# Altium schematic sheet Communication_Management.SchDoc
size A2; SheetNumber: 4; SheetTotal: 4
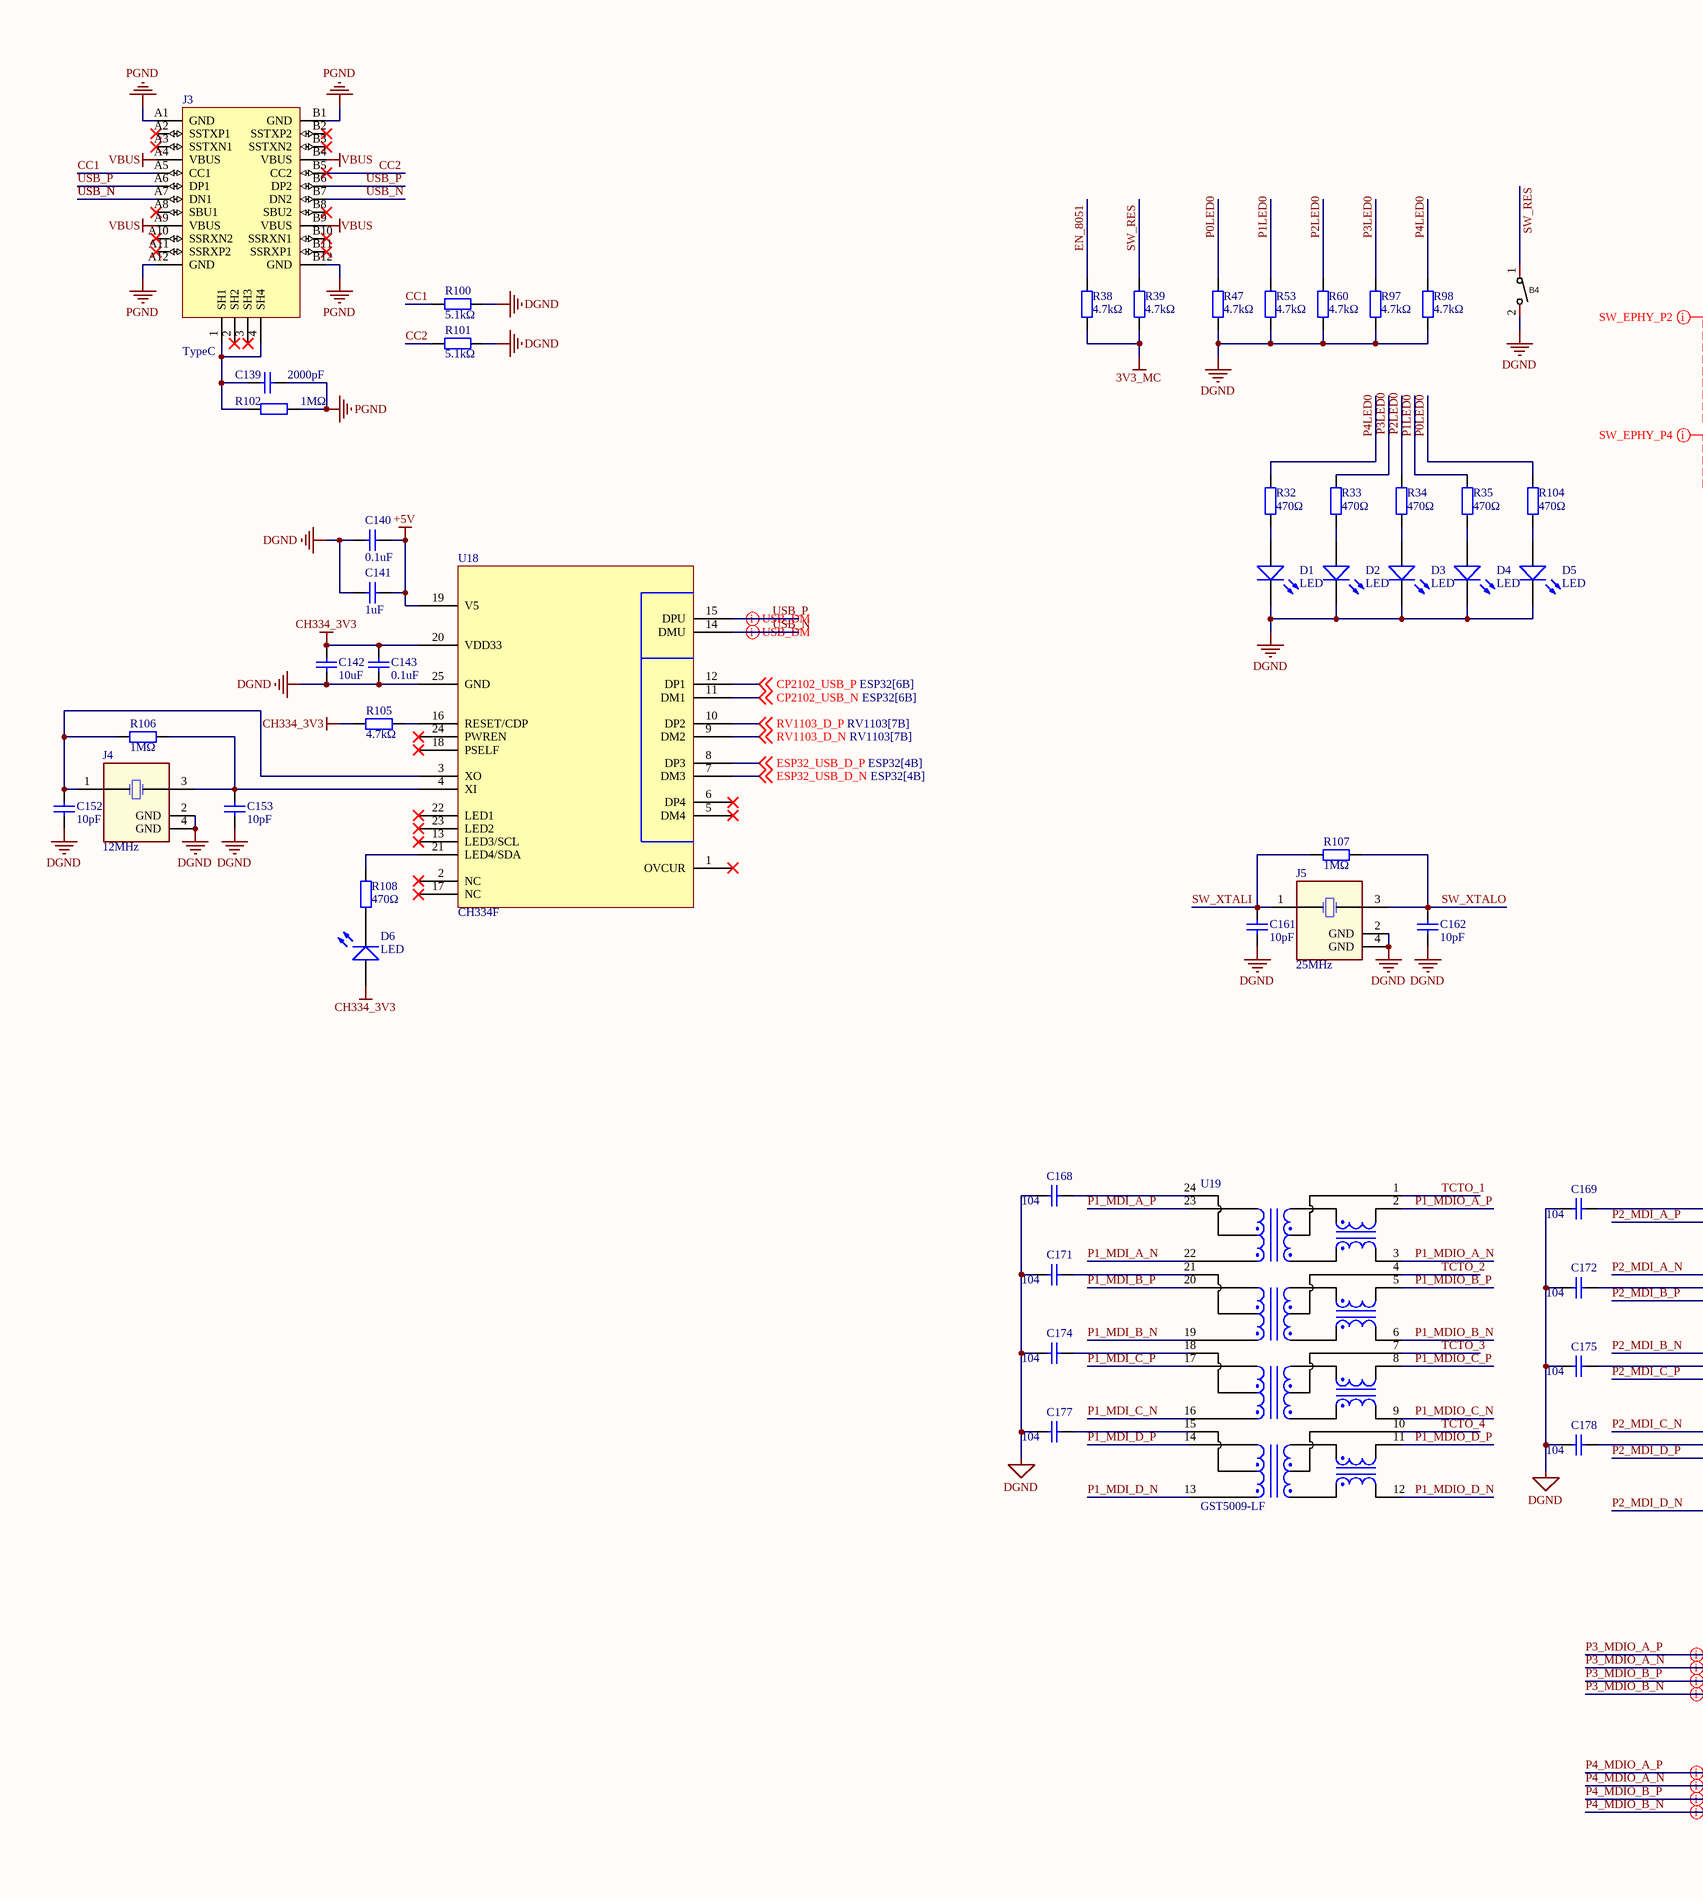
[diagram p0: Communication_Management.SchDoc, left]
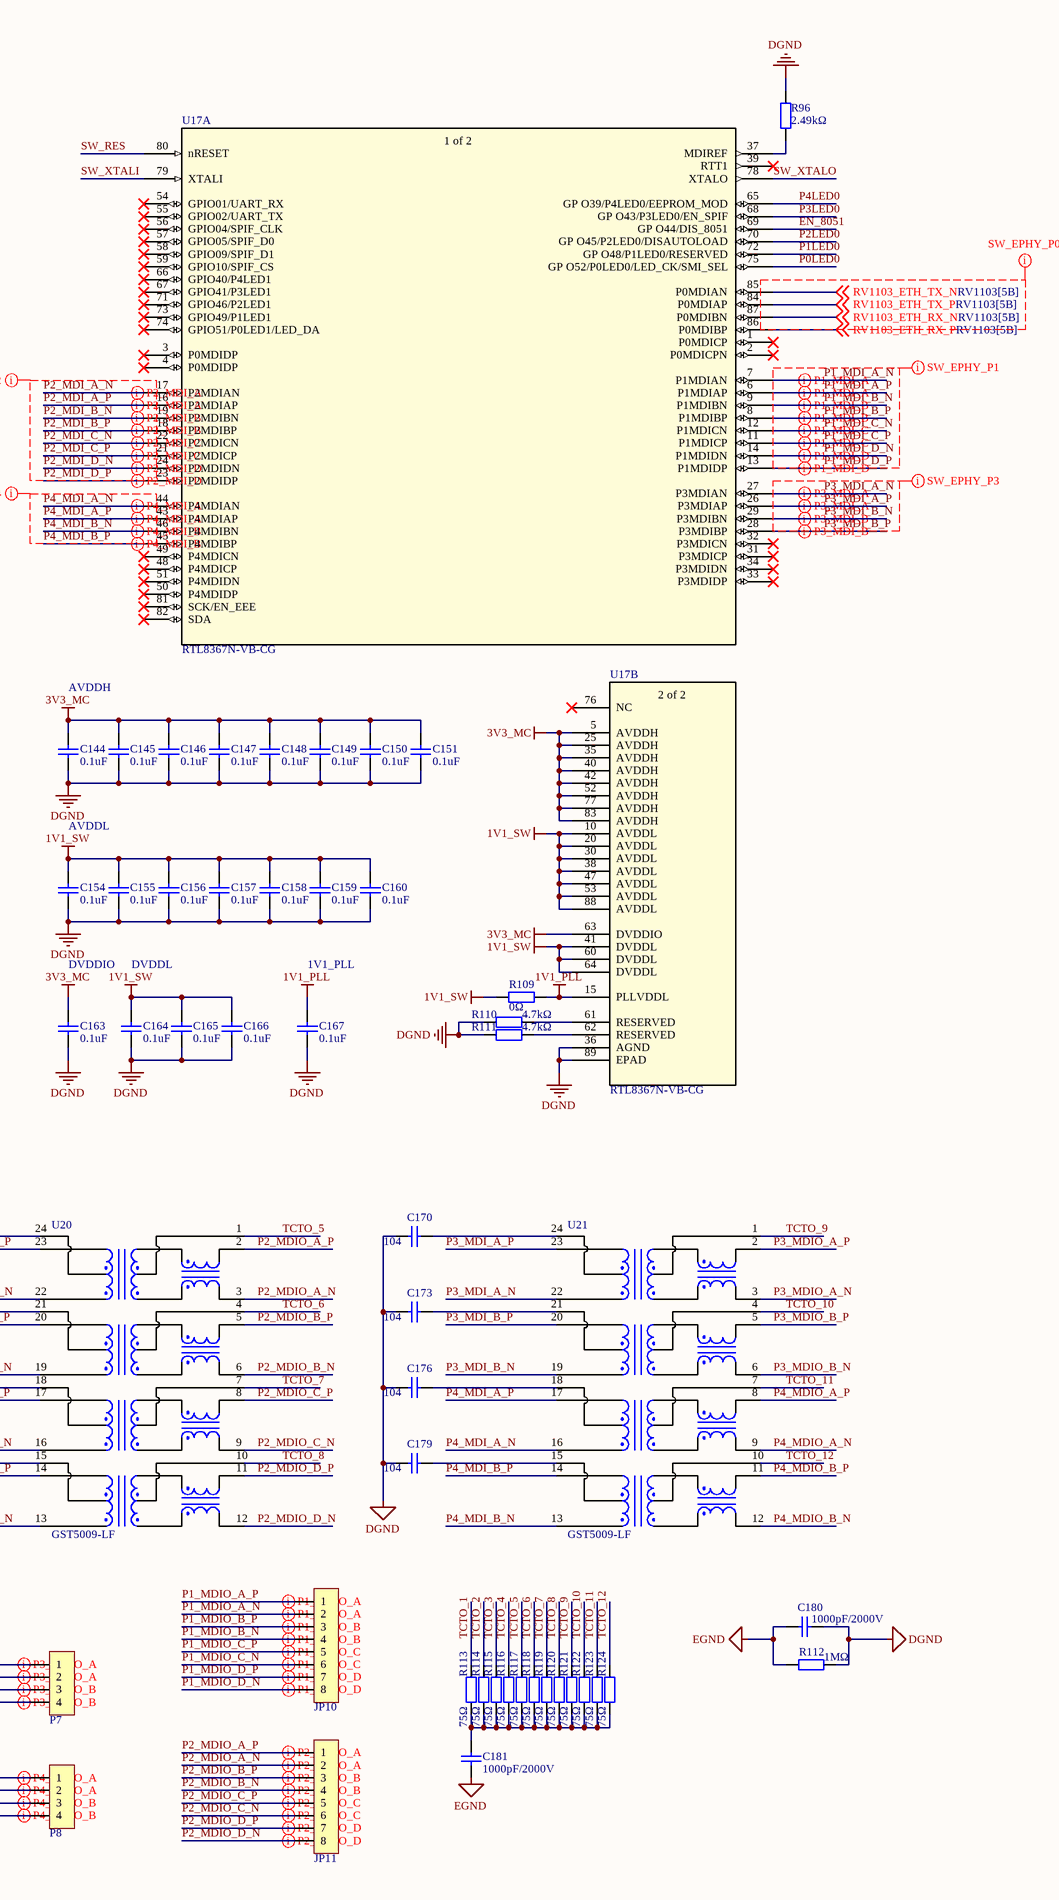
[diagram p1: Communication_Management.SchDoc, right]

## Parts
B4  Bottom-2P-1Way  [SW-SMD_L4.0-W2.9-LS5.0]  (value not drawn)
C139  2000pF  [1210_C]
C140  0.1uF  [0603_C]
C141  1uF  [0603_C]
C142  10uF  [0603_C]
C143  0.1uF  [0603_C]
C144  0.1uF  [0402_C]
C145  0.1uF  [0402_C]
C146  0.1uF  [0402_C]
C147  0.1uF  [0402_C]
C148  0.1uF  [0402_C]
C149  0.1uF  [0402_C]
C150  0.1uF  [0402_C]
C151  0.1uF  [0402_C]
C152  10pF  [0603_C]
C153  10pF  [0603_C]
C154  0.1uF  [0402_C]
C155  0.1uF  [0402_C]
C156  0.1uF  [0402_C]
C157  0.1uF  [0402_C]
C158  0.1uF  [0402_C]
C159  0.1uF  [0402_C]
C160  0.1uF  [0402_C]
C161  10pF  [0402_C]
C162  10pF  [0402_C]
C163  0.1uF  [0402_C]
C164  0.1uF  [0402_C]
C165  0.1uF  [0402_C]
C166  0.1uF  [0402_C]
C167  0.1uF  [0402_C]
C168  104  [0402_C]
C169  104  [0402_C]
C170  104  [0402_C]
C171  104  [0402_C]
C172  104  [0402_C]
C173  104  [0402_C]
C174  104  [0402_C]
C175  104  [0402_C]
C176  104  [0402_C]
C177  104  [0402_C]
C178  104  [0402_C]
C179  104  [0402_C]
C180  1000pF/2000V  [1210_C]
C181  1000pF/2000V  [1210_C]
D1  LED  [0603_LED]
D2  LED  [0603_LED]
D3  LED  [0603_LED]
D4  LED  [0603_LED]
D5  LED  [0603_LED]
D6  LED  [0603_LED]
J3  TypeC  [TYPE-C 16P]
J4  12MHz  [SMD-2520_4P]
J5  25MHz  [SMD-2520_4P]
JP10  HDR-1X8  [MX 1.25-LI-8P]  (value not drawn)
JP11  HDR-1X8  [MX 1.25-LI-8P]  (value not drawn)
P7  HDR-1X4  [MX 1.25-LI-4P]  (value not drawn)
P8  HDR-1X4  [MX 1.25-LI-4P]  (value not drawn)
R32  470Ω  [0603_R]
R33  470Ω  [0603_R]
R34  470Ω  [0603_R]
R35  470Ω  [0603_R]
R38  4.7kΩ  [0402_R]
R39  4.7kΩ  [0402_R]
R47  4.7kΩ  [0402_R]
R53  4.7kΩ  [0402_R]
R60  4.7kΩ  [0402_R]
R96  2.49kΩ  [0402_R]
R97  4.7kΩ  [0402_R]
R98  4.7kΩ  [0402_R]
R100  5.1kΩ  [0603_R]
R101  5.1kΩ  [0603_R]
R102  1MΩ  [1206_R]
R104  470Ω  [0603_R]
R105  4.7kΩ  [0603_R]
R106  1MΩ  [0603_R]
R107  1MΩ  [0603_R]
R108  470Ω  [0603_R]
R109  0Ω  [0402_R]
R110  4.7kΩ  [0402_R]
R111  4.7kΩ  [0402_R]
R112  1MΩ  [1206_R]
R113  75Ω  [0402_R]
R114  75Ω  [0402_R]
R115  75Ω  [0402_R]
R116  75Ω  [0402_R]
R117  75Ω  [0402_R]
R118  75Ω  [0402_R]
R119  75Ω  [0402_R]
R120  75Ω  [0402_R]
R121  75Ω  [0402_R]
R122  75Ω  [0402_R]
R123  75Ω  [0402_R]
R124  75Ω  [0402_R]
U17  RTL8367N-VB-CG  [QFN88-10x10MM]  (parts A,B of 2)
U18  CH334F  [QFN50P400X400X80_HS-25N]
U19  GST5009-LF  [SOP100P1000X400-24N]
U20  GST5009-LF  [SOP100P1000X400-24N]
U21  GST5009-LF  [SOP100P1000X400-24N]

## Nets
1V1_PLL: C167.2 R109.2 U17.15(PLLVDDL)
1V1_SW: C154.2 C155.2 C156.2 C157.2 C158.2 C159.2 C160.2 C164.2 C165.2 C166.2 R109.1 U17.10(AVDDL) U17.20(AVDDL) U17.30(AVDDL) U17.38(AVDDL) U17.41(DVDDL) U17.47(AVDDL) U17.53(AVDDL) U17.60(DVDDL) U17.64(DVDDL) U17.88(AVDDL)
3V3_MC: C144.2 C145.2 C146.2 C147.2 C148.2 C149.2 C150.2 C151.2 C163.2 R38.2 R39.2 U17.5(AVDDH) U17.25(AVDDH) U17.35(AVDDH) U17.40(AVDDH) U17.42(AVDDH) U17.52(AVDDH) U17.63(DVDDIO) U17.77(AVDDH) U17.83(AVDDH)
+5V: C140.2 C141.2 U18.19(V5)
CH334_3V3: C142.2 C143.2 D6.A R105.1 U18.20(VDD33)
DGND: B4.2 C140.1 C141.1 C142.1 C143.1 C144.1 C145.1 C146.1 C147.1 C148.1 C149.1 C150.1 C151.1 C152.1 C153.1 C154.1 C155.1 C156.1 C157.1 C158.1 C159.1 C160.1 C161.1 C162.1 C163.1 C164.1 C165.1 C166.1 C167.1 C168.2 C169.2 C170.2 C171.2 C172.2 C173.2 C174.2 C175.2 C176.2 C177.2 C178.2 C179.2 C180.1 D1.K D2.K D3.K D4.K D5.K J4.2(GND) J4.4(GND) J5.2(GND) J5.4(GND) R47.1 R53.1 R60.1 R96.2 R97.1 R98.1 R100.1 R101.1 R110.1 R111.1 R112.2 U17.36(AGND) U17.89(EPAD) U18.25(GND)
EGND: C180.2 C181.1 R112.1
PGND: C139.2 J3.A1(GND) J3.A12(GND) J3.B1(GND) J3.B12(GND) R102.2
VBUS: J3.A4(VBUS) J3.A9(VBUS) J3.B4(VBUS) J3.B9(VBUS)
CC1: J3.A5(CC1) R100.2
CC2: J3.B5(CC2) R101.2
CP2102_USB_N: U18.11(DM1) ; off-sheet CP2102_USB_N
CP2102_USB_P: U18.12(DP1) ; off-sheet CP2102_USB_P
EN_8051: R38.1 U17.69(GP_O44/DIS_8051)
ESP32_USB_D_N: U18.7(DM3) ; off-sheet ESP32_USB_D_N
ESP32_USB_D_P: U18.8(DP3) ; off-sheet ESP32_USB_D_P
P0LED0: R47.2 R104.2 U17.75(GP_O52/P0LED0/LED_CK/SMI_SEL)
P1_MDI_A_N: U17.7(P1MDIAN) U19.22
P1_MDI_A_P: U17.6(P1MDIAP) U19.23
P1_MDI_B_N: U17.9(P1MDIBN) U19.19
P1_MDI_B_P: U17.8(P1MDIBP) U19.20
P1_MDI_C_N: U17.12(P1MDICN) U19.16
P1_MDI_C_P: U17.11(P1MDICP) U19.17
P1_MDI_D_N: U17.14(P1MDIDN) U19.13
P1_MDI_D_P: U17.13(P1MDIDP) U19.14
P1_MDIO_A_N: JP10.2 U19.3
P1_MDIO_A_P: JP10.1 U19.2
P1_MDIO_B_N: JP10.4 U19.6
P1_MDIO_B_P: JP10.3 U19.5
P1_MDIO_C_N: JP10.6 U19.9
P1_MDIO_C_P: JP10.5 U19.8
P1_MDIO_D_N: JP10.8 U19.12
P1_MDIO_D_P: JP10.7 U19.11
P1LED0: R35.2 R53.2 U17.72(GP_O48/P1LED0/RESERVED)
P2_MDI_A_N: U17.17(P2MDIAN) U20.22
P2_MDI_A_P: U17.16(P2MDIAP) U20.23
P2_MDI_B_N: U17.19(P2MDIBN) U20.19
P2_MDI_B_P: U17.18(P2MDIBP) U20.20
P2_MDI_C_N: U17.22(P2MDICN) U20.16
P2_MDI_C_P: U17.21(P2MDICP) U20.17
P2_MDI_D_N: U17.24(P2MDIDN) U20.13
P2_MDI_D_P: U17.23(P2MDIDP) U20.14
P2_MDIO_A_N: JP11.2 U20.3
P2_MDIO_A_P: JP11.1 U20.2
P2_MDIO_B_N: JP11.4 U20.6
P2_MDIO_B_P: JP11.3 U20.5
P2_MDIO_C_N: JP11.6 U20.9
P2_MDIO_C_P: JP11.5 U20.8
P2_MDIO_D_N: JP11.8 U20.12
P2_MDIO_D_P: JP11.7 U20.11
P2LED0: R34.2 R60.2 U17.70(GP_O45/P2LED0/DISAUTOLOAD)
P3_MDI_A_N: U17.27(P3MDIAN) U21.22
P3_MDI_A_P: U17.26(P3MDIAP) U21.23
P3_MDI_B_N: U17.29(P3MDIBN) U21.19
P3_MDI_B_P: U17.28(P3MDIBP) U21.20
P3_MDIO_A_N: P7.2 U21.3
P3_MDIO_A_P: P7.1 U21.2
P3_MDIO_B_N: P7.4 U21.6
P3_MDIO_B_P: P7.3 U21.5
P3LED0: R33.2 R97.2 U17.68(GP_O43/P3LED0/EN_SPIF)
P4_MDI_A_N: U17.44(P4MDIAN) U21.16
P4_MDI_A_P: U17.43(P4MDIAP) U21.17
P4_MDI_B_N: U17.46(P4MDIBN) U21.13
P4_MDI_B_P: U17.45(P4MDIBP) U21.14
P4_MDIO_A_N: P8.2 U21.9
P4_MDIO_A_P: P8.1 U21.8
P4_MDIO_B_N: P8.4 U21.12
P4_MDIO_B_P: P8.3 U21.11
P4LED0: R32.2 R98.2 U17.65(GP_O39/P4LED0/EEPROM_MOD)
RV1103_D_N: U18.9(DM2) ; off-sheet RV1103_D_N
RV1103_D_P: U18.10(DP2) ; off-sheet RV1103_D_P
RV1103_ETH_RX_N: U17.87(P0MDIBN) ; off-sheet RV1103_ETH_RX_N
RV1103_ETH_RX_P: U17.86(P0MDIBP) ; off-sheet RV1103_ETH_RX_P
RV1103_ETH_TX_N: U17.85(P0MDIAN) ; off-sheet RV1103_ETH_TX_N
RV1103_ETH_TX_P: U17.84(P0MDIAP) ; off-sheet RV1103_ETH_TX_P
SW_RES: B4.1 R39.1 U17.80(nRESET)
SW_XTALI: C161.2 J5.1(OSC1) R107.1 U17.79(XTALI)
SW_XTALO: C162.2 J5.3(OSC2) R107.2 U17.78(XTALO)
TCTO_1: R113.2 U19.1
TCTO_2: R114.2 U19.4
TCTO_3: R115.2 U19.7
TCTO_4: R116.2 U19.10
TCTO_5: R117.2 U20.1
TCTO_6: R118.2 U20.4
TCTO_7: R119.2 U20.7
TCTO_8: R120.2 U20.10
TCTO_9: R121.2 U21.1
TCTO_10: R122.2 U21.4
TCTO_11: R123.2 U21.7
TCTO_12: R124.2 U21.10
USB_N: J3.A7(DN1) J3.B7(DN2) U18.14(DMU)
USB_P: J3.A6(DP1) J3.B6(DP2) U18.15(DPU)
NetC139_1: C139.1 J3.1(SH1) J3.4(SH4) R102.1
NetC152_2: C152.2 J4.1(OSC1) R106.1 U18.3(XO)
NetC153_2: C153.2 J4.3(OSC2) R106.2 U18.4(XI)
NetC168_1: C168.1 U19.24
NetC169_1: C169.1 U20.24
NetC170_1: C170.1 U21.24
NetC171_1: C171.1 U19.21
NetC172_1: C172.1 U20.21
NetC173_1: C173.1 U21.21
NetC174_1: C174.1 U19.18
NetC175_1: C175.1 U20.18
NetC176_1: C176.1 U21.18
NetC177_1: C177.1 U19.15
NetC178_1: C178.1 U20.15
NetC179_1: C179.1 U21.15
NetC181_2: C181.2 R113.1 R114.1 R115.1 R116.1 R117.1 R118.1 R119.1 R120.1 R121.1 R122.1 R123.1 R124.1
NetD1_A: D1.A R32.1
NetD2_A: D2.A R33.1
NetD3_A: D3.A R34.1
NetD4_A: D4.A R35.1
NetD5_A: D5.A R104.1
NetD6_K: D6.K R108.1
NetR96_1: R96.1 U17.37(MDIREF)
NetR105_2: R105.2 U18.16(RESET/CDP)
NetR108_2: R108.2 U18.21(LED4/SDA)
NetR110_2: R110.2 U17.61(RESERVED)
NetR111_2: R111.2 U17.62(RESERVED)

Not connected (* = marked no-connect by the designer): J3 2(SH2)* 3(SH3)* A2(SSTXP1)* A3(SSTXN1)* A8(SBU1)* A10(SSRXN2)* A11(SSRXP2)* B2(SSTXP2)* B3(SSTXN2)* B8(SBU2)* B10(SSRXN1)* B11(SSRXP1)*; U17 1(P0MDICP)* 2(P0MDICPN)* 3(P0MDIDP)* 4(P0MDIDP)* 31(P3MDICP)* 32(P3MDICN)* 33(P3MDIDP)* 34(P3MDIDN)* 39(RTT1)* 48(P4MDICP)* 49(P4MDICN)* 50(P4MDIDP)* 51(P4MDIDN)* 54(GPIO01/UART_RX)* 55(GPIO02/UART_TX)* 56(GPIO04/SPIF_CLK)* 57(GPIO05/SPIF_D0)* 58(GPIO09/SPIF_D1)* 59(GPIO10/SPIF_CS)* 66(GPIO40/P4LED1)* 67(GPIO41/P3LED1)* 71(GPIO46/P2LED1)* 73(GPIO49/P1LED1)* 74(GPIO51/P0LED1/LED_DA)* 76(NC)* 81(SCK/EN_EEE)* 82(SDA)*; U18 1(OVCUR)* 2(NC)* 5(DM4)* 6(DP4)* 13(LED3/SCL)* 17(NC)* 18(PSELF)* 22(LED1)* 23(LED2)* 24(PWREN)*

## Layout directives
differential pair: P1_MDI_A_N, P1_MDI_A_P, P1_MDI_B_N, P1_MDI_B_P, P1_MDI_C_N, P1_MDI_C_P, P1_MDI_D_N, P1_MDI_D_P, P1_MDIO_A_N, P1_MDIO_A_P, P1_MDIO_B_N, P1_MDIO_B_P, P1_MDIO_C_N, P1_MDIO_C_P, P1_MDIO_D_N, P1_MDIO_D_P, P2_MDI_A_N, P2_MDI_A_P, P2_MDI_B_N, P2_MDI_B_P, P2_MDI_C_N, P2_MDI_C_P, P2_MDI_D_N, P2_MDI_D_P, P2_MDIO_A_N, P2_MDIO_A_P, P2_MDIO_B_N, P2_MDIO_B_P, P2_MDIO_C_N, P2_MDIO_C_P, P2_MDIO_D_N, P2_MDIO_D_P, P3_MDI_A_N, P3_MDI_A_P, P3_MDI_B_N, P3_MDI_B_P, P3_MDIO_A_N, P3_MDIO_A_P, P3_MDIO_B_N, P3_MDIO_B_P, P4_MDI_A_N, P4_MDI_A_P, P4_MDI_B_N, P4_MDI_B_P, P4_MDIO_A_N, P4_MDIO_A_P, P4_MDIO_B_N, P4_MDIO_B_P, USB_N, USB_P
net class SW_EPHY_P2: P2_MDI_A_N, P2_MDI_A_P, P2_MDI_B_N, P2_MDI_B_P, P2_MDI_C_N, P2_MDI_C_P, P2_MDI_D_N, P2_MDI_D_P
net class SW_EPHY_P4: P4_MDI_A_N, P4_MDI_A_P, P4_MDI_B_N, P4_MDI_B_P
net class SW_EPHY_P0: RV1103_ETH_RX_N, RV1103_ETH_RX_P, RV1103_ETH_TX_N, RV1103_ETH_TX_P
net class SW_EPHY_P1: P1_MDI_A_N, P1_MDI_A_P, P1_MDI_B_N, P1_MDI_B_P, P1_MDI_C_N, P1_MDI_C_P, P1_MDI_D_N, P1_MDI_D_P
net class SW_EPHY_P3: P3_MDI_A_N, P3_MDI_A_P, P3_MDI_B_N, P3_MDI_B_P

## Notes on the sheet
- AVDDH
- AVDDL
- DVDDIO
- DVDDL
- 1V1_PLL
- (in symbol RTL8367N-VB-CG, part A) 1 of 2
- (in symbol RTL8367N-VB-CG, part B) 2 of 2

## Library data of the parts
B4 = Bottom-2P-1Way: 轻触按键; Manufacturer: SHOU HAN(首韩); Symbol: TS342A2P-WZ; Add into BOM: yes; Device: TS342A2P-WZ; LCSC Part Name: 轻触开关 3*4*2 两脚小龟不带柱 250gf 黑色塑胶按钮; Supplier Part: C557591; Manufacturer Part: TS342A2P-WZ; Supplier Footprint: SMD; JLCPCB Part Class: Extended Part; Datasheet: https://atta.szlcsc.com/upload/public/pdf/source/20200519/C557591_B3A5A21584733303F06306F18577DA8B.pdf; Supplier: LCSC; Convert to PCB: yes
C139-C181 = SMT_Cap: 贴片电容; ComponentLink1Description: 供应商链接; ComponentLink1URL: http://www.szlcsc.com/product/details_29010.html; Package: 0805; Supplier: LC; SuppliersPartNumber: C28260
D1-D6 = LED: 发光二极管; ComponentLink1Description: 供应商链接; ComponentLink1URL: http://www.szlcsc.com/product/details_2663.html; Package: 0603; Supplier: LC; SuppliersPartNumber: C2290
J4 J5 = Oscillator_SMT_4P
JP10 JP11 = Header 8: 8P接插件; 卖家免费技术支持，联系售后: 唯一出售店铺网址https://shop463601444.taobao.com; 封装库来自淘宝卖家 ID：黄晶宝石: 其他店铺购入均为假冒，请申请退款，本店现金奖励; 优秀评价可免费更新封装库: 联系淘宝ID：黄晶宝石，获取更新版封装库; BOM名称: 8P接插件
P7 P8 = Header 4: 4P接插件; 卖家免费技术支持，联系售后: 唯一出售店铺网址https://shop463601444.taobao.com; 封装库来自淘宝卖家 ID：黄晶宝石: 其他店铺购入均为假冒，请申请退款，本店现金奖励; 优秀评价可免费更新封装库: 联系淘宝ID：黄晶宝石，获取更新版封装库; BOM名称: 4P接插件
R32-R35 R38 R39 R47 R53 R60 R96-R98 R100-R102 R104-R124 = SMT_Res: 贴片电阻; ComponentLink1Description: 供应商链接; ComponentLink1URL: http://www.szlcsc.com/product/details_23980.html; Package: 0603; Supplier: LC; SuppliersPartNumber: C23253
U17 = RTL8367N-VB-CG: SINGLE-CHIP 5-PORT 10/100/1000M / SWITCH CONTROLLER; Mfr_Name: Realtek; Copyright: Copyright (C) 2023 Ultra Librarian. All rights reserved.; Manufacturer_Part_Number: RTL8367N-VB-CG; RefDes: RefDes; Type: DEV
U18 = CH334F: USB hub controller
U19-U21 = GST5009-LF: Network